# EAGLE design TopHat-V1 (EAGLE 7.4.0)
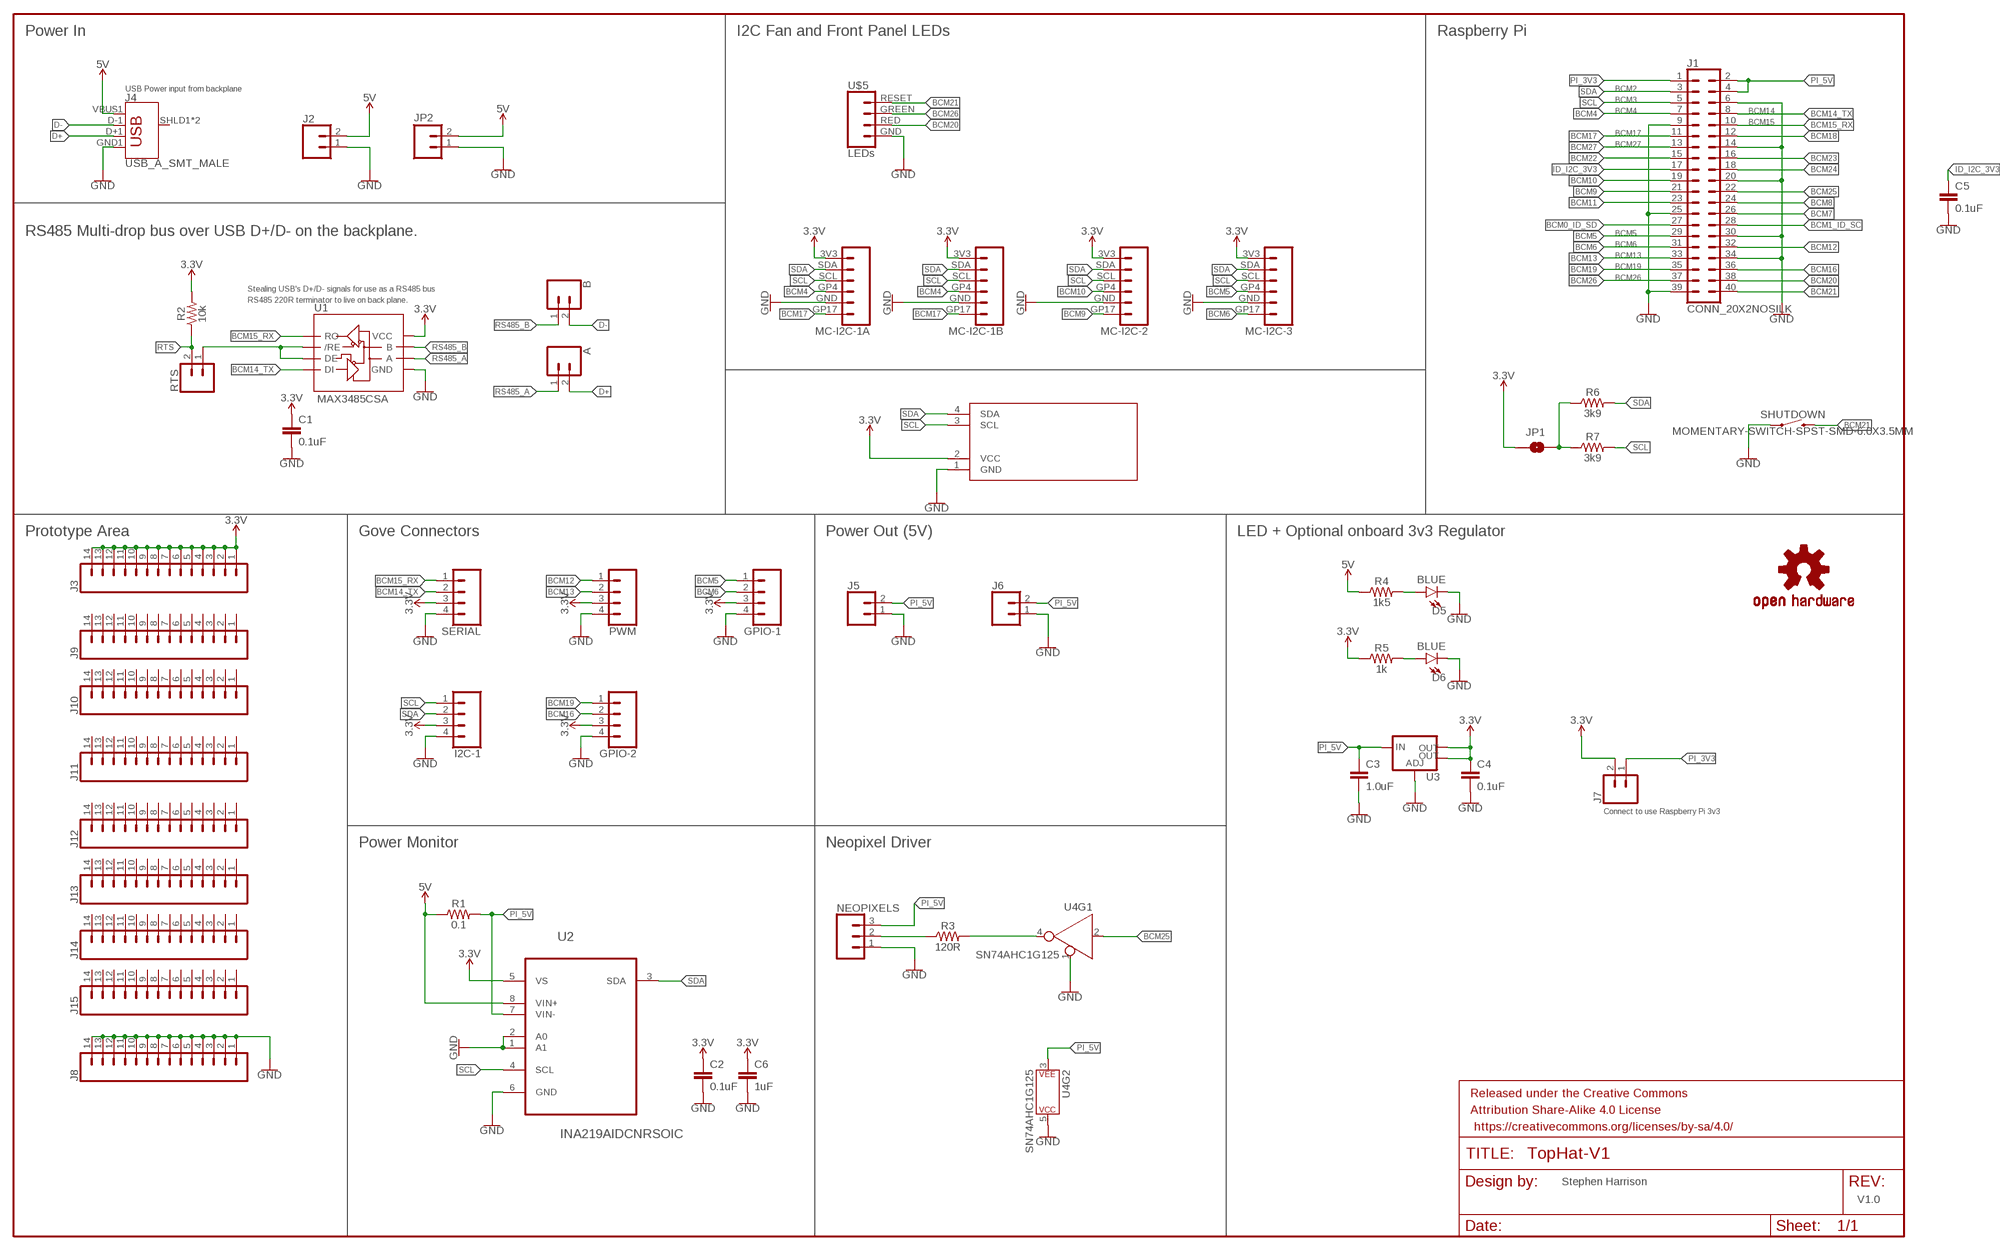
[diagram p0: schematic, sheet 1, part 1 of 2]
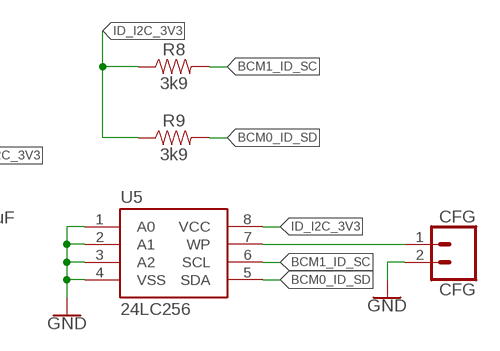
[diagram p1: schematic, sheet 1, part 2 of 2]

## Parts
A  CONN_02  [1X02]
B  CONN_02  [1X02]
C1  0.1uF  1.0UF-0805-25V-(+80/-20%)  [0805]
C2  0.1uF  1.0UF-0805-25V-(+80/-20%)  [0805]
C3  1.0uF  1.0UF-0805-25V-(+80/-20%)  [0805]
C4  0.1uF  1.0UF-0805-25V-(+80/-20%)  [0805]
C5  0.1uF  1.0UF-0805-25V-(+80/-20%)  [0805]
C6  1uF  1.0UF-0805-25V-(+80/-20%)  [0805]
CFG  CFG  CONN_02  [1X02]
D5  BLUE  LED-BLUE1206  [LED-1206]
D6  BLUE  LED-BLUE1206  [LED-1206]
DISPLAY  DISPLAY0.91_INCH_DISPLAY  [I2C_DISPLAY_0.91_INCH]
FRAME1  FRAME-LEDGER  [CREATIVE_COMMONS]
GPIO-1  CONN_04GROVE-JST-PH-4-2MM  [JST-4-PH-GROVE]
GPIO-2  CONN_04GROVE-JST-PH-4-2MM  [JST-4-PH-GROVE]
I2C-1  CONN_04GROVE-JST-PH-4-2MM  [JST-4-PH-GROVE]
J1  CONN_20X2NOSILK  [2X20_NOSILK]
J2  CONN_02POLAR  [MOLEX-1X2]
J3  CONN_14  [1X14]
J4  USB_A_SMT_MALE  [USB-A-SMT-MALE]
J5  CONN_02POLAR  [MOLEX-1X2]
J6  CONN_02POLAR  [MOLEX-1X2]
J7  CONN_02  [1X02]
J8  CONN_14  [1X14]
J9  CONN_14NO_SILK  [1X14_NO_SILK]
J10  CONN_14NO_SILK  [1X14_NO_SILK]
J11  CONN_14NO_SILK  [1X14_NO_SILK]
J12  CONN_14NO_SILK  [1X14_NO_SILK]
J13  CONN_14NO_SILK  [1X14_NO_SILK]
J14  CONN_14NO_SILK  [1X14_NO_SILK]
J15  CONN_14NO_SILK  [1X14_NO_SILK]
JP1  JUMPER-SMT_2_NO_SILK  [SMT-JUMPER_2_NO_SILK]
JP2  M025MM  [SCREWTERMINAL-5MM-2@1]
LOGO1  OSHW-LOGOM  [OSHW-LOGO-M]
MC-I2C-1A  MC_PI_FACE_CONNECTORS_I2CTOP  [JST-6-SH-1.0MM-TOP]
MC-I2C-1B  MC_PI_FACE_CONNECTORS_I2CTOP  [JST-6-SH-1.0MM-TOP]
MC-I2C-2  MC_PI_FACE_CONNECTORS_I2CTOP  [JST-6-SH-1.0MM-TOP]
MC-I2C-3  MC_PI_FACE_CONNECTORS_I2CTOP  [JST-6-SH-1.0MM-TOP]
NEOPIXELS  CONN_03POLAR  [MOLEX-1X3]
PWM  CONN_04GROVE-JST-PH-4-2MM  [JST-4-PH-GROVE]
R1  0.1  0.1OHM-1210-1/2W-1%  [1210]
R2  10k  RESISTOR0805  [0805]
R3  120R  RESISTOR0805  [0805]
R4  1k5  RESISTOR0805  [0805]
R5  1k  RESISTOR0805  [0805]
R6  3k9  RESISTOR0805  [0805]
R7  3k9  RESISTOR0805  [0805]
R8  3k9  RESISTOR0805  [0805]
R9  3k9  RESISTOR0805  [0805]
RTS  CONN_02  [1X02]
SERIAL  CONN_04GROVE-JST-PH-4-2MM  [JST-4-PH-GROVE]
SHUTDOWN  MOMENTARY-SWITCH-SPST-SMD-6.0X3.5MM  [TACTILE_SWITCH_SMD_6.0X3.5MM]
U1  MAX3485CSA  RS485SOIC  [SO08]
U2  INA219AIDCNRSOIC  [SO08]
U3  V_REG_LM1117SOT223  [SOT223]
U4  SN74AHC1G125  74AHC1G125D  [SOT23-5]
U5  24LC256  EEPROM-I2CSMD  [SO08]
U$1  THINGYSTICKS_LOGO  [THINGYSTICKS_LOGO]
U$5  LEDs  MC_PI_FACE_CONNECTORS_LEDSSIDE  [JST-4-SH-1.0MM-SIDE]

## Nets
3.3V: C1.1 C2.1 C4.1 C6.1 DISPLAY.2(VCC) GPIO-1.3 GPIO-2.3 I2C-1.3 J3.1 J3.2 J3.3 J3.4 J3.5 J3.6 J3.7 J3.8 J3.9 J3.10 J3.11 J3.12 J3.13 J3.14 J7.2 JP1.1 MC-I2C-1A.3V3 MC-I2C-1B.3V3 MC-I2C-2.3V3 MC-I2C-3.3V3 PWM.3 R2.2 R5.1 SERIAL.3 U1.8(VCC) U2.5(VS) U3.2(OUT) U3.4(OUT)
5V: J2.2 J4.VBUS1(VBUS) JP2.2 R1.1 R4.1 U2.8(VIN+)
BCM0_ID_SD: J1.27 R9.2 U5.5(SDA)
BCM1_ID_SC: J1.28 R8.2 U5.6(SCL)
BCM4: J1.7 MC-I2C-1A.GP4 MC-I2C-1B.GP4
BCM5: GPIO-1.1 J1.29 MC-I2C-3.GP4
BCM6: GPIO-1.2 J1.31 MC-I2C-3.GP17
BCM7: J1.26
BCM8: J1.24
BCM9: J1.21 MC-I2C-2.GP17
BCM10: J1.19 MC-I2C-2.GP4
BCM11: J1.23
BCM12: J1.32 PWM.1
BCM13: J1.33 PWM.2
BCM14_TX: J1.8 SERIAL.2 U1.4(DI)
BCM15_RX: J1.10 SERIAL.1 U1.1(RO)
BCM16: GPIO-2.2 J1.36
BCM17: J1.11 MC-I2C-1A.GP17 MC-I2C-1B.GP17
BCM18: J1.12
BCM19: GPIO-2.1 J1.35
BCM20: J1.38 U$5.RED
BCM21: J1.40 SHUTDOWN.2 U$5.RESET
BCM22: J1.15
BCM23: J1.16
BCM24: J1.18
BCM25: J1.22 U4.2(A)
BCM26: J1.37 U$5.GREEN
BCM27: J1.13
D+: A.2 J4.D+1(D+)
D-: B.2 J4.D-1(D-)
GND: C1.2 C2.2 C3.2 C4.2 C5.2 C6.2 CFG.2 D5.C D6.C DISPLAY.1(GND) GPIO-1.4 GPIO-2.4 I2C-1.4 J1.6 J1.9 J1.14 J1.20 J1.25 J1.30 J1.34 J1.39 J2.1 J4.GND1(GND) J5.1 J6.1 J8.1 J8.2 J8.3 J8.4 J8.5 J8.6 J8.7 J8.8 J8.9 J8.10 J8.11 J8.12 J8.13 J8.14 JP2.1 MC-I2C-1A.GND MC-I2C-1B.GND MC-I2C-2.GND MC-I2C-3.GND NEOPIXELS.1 PWM.4 SERIAL.4 SHUTDOWN.1 U1.5(GND) U2.1(A1) U2.2(A0) U2.6(GND) U3.1(ADJ) U4.1(!EN) U4.5(P$V+) U5.1(A0) U5.2(A1) U5.3(A2) U5.4(VSS) U$5.GND
ID_I2C_3V3: C5.1 J1.17 R8.1 R9.1 U5.8(VCC)
N$1: CFG.1 U5.7(WP)
N$2: D6.A R5.2
N$4: D5.A R4.2
N$6: RTS.1 U1.2(/RE) U1.3(DE)
N$7: JP1.2 R6.1 R7.1
N$8: NEOPIXELS.2 R3.1
N$9: R3.2 U4.4(Y)
PI_3V3: J1.1 J7.1
PI_5V: C3.1 J1.2 J1.4 J5.2 J6.2 NEOPIXELS.3 R1.2 U2.7(VIN-) U3.3(IN) U4.3(P$V-)
RS485_A: A.1 U1.6(A)
RS485_B: B.1 U1.7(B)
RTS: R2.1 RTS.2
SCL: DISPLAY.3(SCL) I2C-1.1 J1.5 MC-I2C-1A.SCL MC-I2C-1B.SCL MC-I2C-2.SCL MC-I2C-3.SCL R7.2 U2.4(SCL)
SDA: DISPLAY.4(SDA) I2C-1.2 J1.3 MC-I2C-1A.SDA MC-I2C-1B.SDA MC-I2C-2.SDA MC-I2C-3.SDA R6.2 U2.3(SDA)
Unconnected: J4.SHLD1(SHIELD) J4.SHLD2(SHIELD) J9.1 J9.2 J9.3 J9.4 J9.5 J9.6 J9.7 J9.8 J9.9 J9.10 J9.11 J9.12 J9.13 J9.14 J10.1 J10.2 J10.3 J10.4 J10.5 J10.6 J10.7 J10.8 J10.9 J10.10 J10.11 J10.12 J10.13 J10.14 J11.1 J11.2 J11.3 J11.4 J11.5 J11.6 J11.7 J11.8 J11.9 J11.10 J11.11 J11.12 J11.13 J11.14 J12.1 J12.2 J12.3 J12.4 J12.5 J12.6 J12.7 J12.8 J12.9 J12.10 J12.11 J12.12 J12.13 J12.14 J13.1 J13.2 J13.3 J13.4 J13.5 J13.6 J13.7 J13.8 J13.9 J13.10 J13.11 J13.12 J13.13 J13.14 J14.1 J14.2 J14.3 J14.4 J14.5 J14.6 J14.7 J14.8 J14.9 J14.10 J14.11 J14.12 J14.13 J14.14 J15.1 J15.2 J15.3 J15.4 J15.5 J15.6 J15.7 J15.8 J15.9 J15.10 J15.11 J15.12 J15.13 J15.14

## Notes on the sheet
- Power In | I2C Fan and Front Panel LEDs | Raspberry Pi
- USB Power input from backplane | BCM2
- BCM3
- BCM4 | BCM14
- BCM15
- BCM17
- BCM27
- RS485 Multi-drop bus over USB D+/D- on the backplane. | BCM5
- BCM6
- BCM13
- BCM19
- BCM26
- Stealing USB's D+/D- signals for use as a RS485 bus
- RS485 220R terminator to live on back plane.
- Prototype Area | Gove Connectors | Power Out (5V) | LED + Optional onboard 3v3 Regulator
- Connect to use Raspberry Pi 3v3
- Power Monitor | Neopixel Driver
- Stephen Harrison
- V1.0

## Library data of the parts
A B CFG J7 RTS = SparkFun-Connectors:CONN_02: Multi connection point. Often used as Generic Header-pin footprint for 0.1 inch spaced/style header connections On any of the 0.1 inch spaced packages, you can populate with these: Break Away Headers - Straight <https://www.sparkfun.com/products/116> (PRT-00116) Break Away Male Headers - Right Angle <https://www.sparkfun.com/products/553> (PRT-00553) Female Headers <https://www.sparkfun.com/products/115> (PRT-00115) Break Away Headers - Machine Pin <https://www.sparkfun.com/products/117> (PRT-00117) Break Away Female Headers - Swiss Machine Pin <https://www.sparkfun.com/products/743> (PRT-00743) For SCREWTERMINALS and SPRING TERMINALS visit here: Screw Terimnals on SparkFun.com <https://www.sparkfun.com/search/results?term=Screw+Terminals> (5mm/3.5mm/2.54mm spacing) This device is also useful as a general connection point to wire up your design to another part of your project. Our various solder wires solder well into these plated through hole pads. Hook-Up Wire - Assortment (Stranded, 22 AWG) <https://www.sparkfun.com/products/11375> (PRT-11375) Hook-Up Wire - Assortment (Solid Core, 22 AWG) <https://www.sparkfun.com/products/11367> (PRT-11367) View the entire wire category on our website here <https://www.sparkfun.com/categories/141> Special notes: Molex polarized connector foot print use with: PRT-08233 with associated crimp pins and housings. 2.54_SCREWTERM for use with PRT-10571. 3.5mm Screw Terminal footprints for PRT-08084 5mm Screw Terminal footprints for use with PRT-08432
C1 C2 C4-C6 = SparkFun-Capacitors:1.0UF: 1µF ceramic capacitors A capacitor is a passive two-terminal electrical component used to store electrical energy temporarily in an electric field.; PROD_ID: CAP-11625; VALUE: 1.0uF
C3 = SparkFun-Capacitors:1.0UF: 1µF ceramic capacitors A capacitor is a passive two-terminal electrical component used to store electrical energy temporarily in an electric field.; PROD_ID: CAP-11625
D5 D6 = SparkFun-LED:LED-BLUE: Blue SMD LED Used in manufacturing of various products at SparkFun Packages: 0603 - SMD 0603 package [Product Link] <http://www.digikey.com/product-detail/en/SMLE12BC7TT86/511-1589-2-ND/1641808> 1206 - SMD1206 package [Product Link] <http://www.digikey.com/product-detail/en/lite-on-inc/LTST-C150TBKT/160-1643-1-ND/573584> SparkFun Products: ESP8266 Thing-Dev Board <https://www.sparkfun.com/products/13711> RedBoard <https://www.sparkfun.com/products/12757>; PROD_ID: DIO-09911
DISPLAY = ThingySticks:DISPLAY
FRAME1 = SparkFun-Aesthetics:FRAME-LEDGER: Schematic Frame - Ledger Standard 11x14 US Ledger frame
GPIO-1 GPIO-2 I2C-1 PWM SERIAL = ThingySticks:CONN_04: Multi connection point. Often used as Generic Header-pin footprint for 0.1 inch spaced/style header connections On any of the 0.1 inch spaced packages, you can populate with these: Break Away Headers - Straight <https://www.sparkfun.com/products/116> (PRT-00116) Break Away Male Headers - Right Angle <https://www.sparkfun.com/products/553> (PRT-00553) Female Headers <https://www.sparkfun.com/products/115> (PRT-00115) Break Away Headers - Machine Pin <https://www.sparkfun.com/products/117> (PRT-00117) Break Away Female Headers - Swiss Machine Pin <https://www.sparkfun.com/products/743> (PRT-00743) For SCREWTERMINALS and SPRING TERMINALS visit here: Screw Terimnals on SparkFun.com <https://www.sparkfun.com/search/results?term=Screw+Terminals> (5mm/3.5mm/2.54mm spacing) This device is also useful as a general connection point to wire up your design to another part of your project. Our various solder wires solder well into these plated through hole pads. Hook-Up Wire - Assortment (Stranded, 22 AWG) <https://www.sparkfun.com/products/11375> (PRT-11375) Hook-Up Wire - Assortment (Solid Core, 22 AWG) <https://www.sparkfun.com/products/11367> (PRT-11367) View the entire wire category on our website here <https://www.sparkfun.com/categories/141> Special notes: Molex polarized connector foot print use with SKU : PRT-08231 with associated crimp pins and housings. 1MM SMD Version SKU: PRT-10208
J1 = SparkFun-Connectors:CONN_20X2: Multi connection point. Often used as Generic Header-pin footprint for 0.1 inch spaced/style header connections On any of the 0.1 inch spaced packages, you can populate with these: Break Away Headers - Straight <https://www.sparkfun.com/products/116> (PRT-00116) Break Away Male Headers - Right Angle <https://www.sparkfun.com/products/553> (PRT-00553) Female Headers <https://www.sparkfun.com/products/115> (PRT-00115) Break Away Headers - Machine Pin <https://www.sparkfun.com/products/117> (PRT-00117) Break Away Female Headers - Swiss Machine Pin <https://www.sparkfun.com/products/743> (PRT-00743)
J2 J5 J6 = SparkFun-Connectors:CONN_02: Multi connection point. Often used as Generic Header-pin footprint for 0.1 inch spaced/style header connections On any of the 0.1 inch spaced packages, you can populate with these: Break Away Headers - Straight <https://www.sparkfun.com/products/116> (PRT-00116) Break Away Male Headers - Right Angle <https://www.sparkfun.com/products/553> (PRT-00553) Female Headers <https://www.sparkfun.com/products/115> (PRT-00115) Break Away Headers - Machine Pin <https://www.sparkfun.com/products/117> (PRT-00117) Break Away Female Headers - Swiss Machine Pin <https://www.sparkfun.com/products/743> (PRT-00743) For SCREWTERMINALS and SPRING TERMINALS visit here: Screw Terimnals on SparkFun.com <https://www.sparkfun.com/search/results?term=Screw+Terminals> (5mm/3.5mm/2.54mm spacing) This device is also useful as a general connection point to wire up your design to another part of your project. Our various solder wires solder well into these plated through hole pads. Hook-Up Wire - Assortment (Stranded, 22 AWG) <https://www.sparkfun.com/products/11375> (PRT-11375) Hook-Up Wire - Assortment (Solid Core, 22 AWG) <https://www.sparkfun.com/products/11367> (PRT-11367) View the entire wire category on our website here <https://www.sparkfun.com/categories/141> Special notes: Molex polarized connector foot print use with: PRT-08233 with associated crimp pins and housings. 2.54_SCREWTERM for use with PRT-10571. 3.5mm Screw Terminal footprints for PRT-08084 5mm Screw Terminal footprints for use with PRT-08432; SF_ID: PRT-09918
J3 J8-J15 = SparkFun-Connectors:CONN_14: Multi connection point. Often used as Generic Header-pin footprint for 0.1 inch spaced/style header connections On any of the 0.1 inch spaced packages, you can populate with these: Break Away Headers - Straight <https://www.sparkfun.com/products/116> (PRT-00116) Break Away Male Headers - Right Angle <https://www.sparkfun.com/products/553> (PRT-00553) Female Headers <https://www.sparkfun.com/products/115> (PRT-00115) Break Away Headers - Machine Pin <https://www.sparkfun.com/products/117> (PRT-00117) Break Away Female Headers - Swiss Machine Pin <https://www.sparkfun.com/products/743> (PRT-00743) For SCREWTERMINALS and SPRING TERMINALS visit here: Screw Terimnals on SparkFun.com <https://www.sparkfun.com/search/results?term=Screw+Terminals> (5mm/3.5mm/2.54mm spacing) This device is also useful as a general connection point to wire up your design to another part of your project. Our various solder wires solder well into these plated through hole pads. Hook-Up Wire - Assortment (Stranded, 22 AWG) <https://www.sparkfun.com/products/11375> (PRT-11375) Hook-Up Wire - Assortment (Solid Core, 22 AWG) <https://www.sparkfun.com/products/11367> (PRT-11367) View the entire wire category on our website here <https://www.sparkfun.com/categories/141> Special notes: Molex polarized connector foot print use with SKU : PRT-08231 with associated crimp pins and housings. 1MM SMD Version SKU: PRT-10208 NOTES ON THE VARIANTS LOCK and LOCK_LONGPADS... This footprint was designed to help hold the alignment of a through-hole component (i.e. 6-pin header) while soldering it into place. You may notice that each hole has been shifted either up or down by 0.005 of an inch from it's more standard position (which is a perfectly straight line). This slight alteration caused the pins (the squares in the middle) to touch the edges of the holes. Because they are alternating, it causes a "brace" to hold the component in place. 0.005 has proven to be the perfect amount of "off-center" position when using our standard breakaway headers. Although looks a little odd when you look at the bare footprint, once you have a header in there, the alteration is very hard to notice. Also,if you push a header all the way into place, it is covered up entirely on the bottom side.
J4 = Tinamous:USB_A: USB-A Connector Male and female variants, as well as PTH and SMT variants SparkFun Products: SparkFun XBee Explorer Dongle <https://www.sparkfun.com/products/11697> PTH Male SparkFun MicroView-USB Programmer <https://www.sparkfun.com/products/12924> SMT Male SparkFun USB Type A Female Breakout <https://www.sparkfun.com/products/12700> SMT Female; PROD_ID: CONN-11499
JP1 = SparkFun-Jumpers:JUMPER-SMT_2_NO: Normally open jumper This jumper has two pads in close proximity to each other. Apply solder to close the connection. Round pads are easier to solder for beginners, but are a lot larger. SparkFun Product that uses the round pads: SparkFun EL Sequencer <https://www.sparkfun.com/products/12781>
JP2 = SparkFun-Connectors:M02: Standard 2-pin 0.1" header. Use with - straight break away headers ( PRT-00116) - right angle break away headers (PRT-00553) - swiss pins (PRT-00743) - machine pins (PRT-00117) - female headers (PRT-00115) Molex polarized connector foot print use with: PRT-08233 with associated crimp pins and housings. 2.54_SCREWTERM for use with PRT-10571. 3.5mm Screw Terminal footprints for PRT-08084 5mm Screw Terminal footprints for use with PRT-08432; STOREFRONT_ID: PRT-08432
LOGO1 = Tinamous:OSHW-LOGO: Open Source Hardware Logo This logo indicates the piece of hardware it is found on incorporates a OSHW license and/or adheres to the definition of open source hardware found here: http://freedomdefined.org/OSHW
MC-I2C-1A MC-I2C-1B MC-I2C-2 MC-I2C-3 = McPiFace:MC_PI_FACE_CONNECTORS_I2C
NEOPIXELS = SparkFun-Connectors:CONN_03: Multi connection point. Often used as Generic Header-pin footprint for 0.1 inch spaced/style header connections On any of the 0.1 inch spaced packages, you can populate with these: Break Away Headers - Straight <https://www.sparkfun.com/products/116> (PRT-00116) Break Away Male Headers - Right Angle <https://www.sparkfun.com/products/553> (PRT-00553) Female Headers <https://www.sparkfun.com/products/115> (PRT-00115) Break Away Headers - Machine Pin <https://www.sparkfun.com/products/117> (PRT-00117) Break Away Female Headers - Swiss Machine Pin <https://www.sparkfun.com/products/743> (PRT-00743) Stackable Header - 3 Pin (Female, 0.1") <https://www.sparkfun.com/products/13875> (PRT-13875) For SCREWTERMINALS and SPRING TERMINALS visit here: Screw Terimnals on SparkFun.com <https://www.sparkfun.com/search/results?term=Screw+Terminals> (5mm/3.5mm/2.54mm spacing) This device is also useful as a general connection point to wire up your design to another part of your project. Our various solder wires solder well into these plated through hole pads. Hook-Up Wire - Assortment (Stranded, 22 AWG) <https://www.sparkfun.com/products/11375> (PRT-11375) Hook-Up Wire - Assortment (Solid Core, 22 AWG) <https://www.sparkfun.com/products/11367> (PRT-11367) View the entire wire category on our website here <https://www.sparkfun.com/categories/141> Special notes: Molex polarized connector foot print use with SKU : PRT-08232 with associated crimp pins and housings.; PROD_ID: CONN-08625; SF_ID: PRT-08096
R1 = SparkFun-Resistors:0.1OHM: 0.1Ω resistor A resistor is a passive two-terminal electrical component that implements electrical resistance as a circuit element. Resistors act to reduce current flow, and, at the same time, act to lower voltage levels within circuits. - Wikipedia; PROD_ID: RES-12374
R2-R9 = SparkFun-Resistors:RESISTOR: Generic Resistor Package
SHUTDOWN = ThingySticks:MOMENTARY-SWITCH-SPST: Momentary Switch (Pushbutton) - SPST Normally-open (NO) SPST momentary switches (buttons, pushbuttons). Variants PTH-12MM - 12mm square, through-hole Momentary Pushbutton Switch - 12mm Square <https://www.sparkfun.com/products/9190> (COM-09190) PTH-6.0MM, PTH-6.0MM-KIT - 6.0mm square, through-hole Mini Pushbutton Switch <https://www.sparkfun.com/products/97> (COM-00097) KIT package intended for soldering kit's - only one side of pads' copper is exposed. PTH-RIGHT-ANGLE-KIT - Right-angle, through-hole Right Angle Tactile Button <https://www.sparkfun.com/products/10791> - Used on SparkFun BigTime Watch Kit <https://www.sparkfun.com/products/11734> SMD-12MM - 12mm square, surface-mount Tactile Button - SMD (12mm) <https://www.sparkfun.com/products/12993> (COM-12993) Used on SparkFun PicoBoard <https://www.sparkfun.com/products/11888> SMD-4.5MM - 4.5mm Square Trackball Switch Used on SparkFun Blackberry Trackballer Breakout <https://www.sparkfun.com/products/13169> SMD-4.6MMX2.8MM - 4.60mm x 2.80mm, surface mount Used on SparkFun SAMD21 Mini Breakout <https://www.sparkfun.com/products/13664> SMD-5.2MM, SMD-5.2-REDUNDANT - 5.2mm square, surface-mount Mini Pushbutton Switch - SMD <https://www.sparkfun.com/products/8720> (COM-08720) Used on Arduino Pro Mini <https://www.sparkfun.com/products/11114> REDUNDANT package connects both switch circuits together SMD-6.0X3.5MM - 6.0 x 3.5mm, surface mount Momentary Reset Switch SMD <https://www.sparkfun.com/products/8229> (COM-08229) SMD-6.2MM-TALL - 6.2mm square, surface mount Tactile Button - SMD (6mm) <https://www.sparkfun.com/products/12992> Used on SparkFun Digital Sandbox <https://www.sparkfun.com/products/12651> SMD-RIGHT-ANGLE - Right-angle, surface mount Used on SparkFun Block for Intel® Edison - Arduino <https://www.sparkfun.com/products/13036>; PROD_ID: SWCH-00815; SF_SKU: COM-08229
U1 = SparkFun-IC-Comms:RS485: RS-485 Transceiver SP3485 Series 8 Pin NSOIC 3.3 V Low Power Half Duplex RS-485 Transceiver MAX3485 compatible Datasheet <http://www.sparkfun.com/datasheets/Components/General/sp3485CN-LTR.pdf> SparkFun Products SparkFun Transceiver Breakout - RS-485 <https://www.sparkfun.com/products/10124> (BOB-10124) SparkFun USB to RS-485 Converter <https://www.sparkfun.com/products/9822> (BOB-09822); PROD_ID: IC-09388
U2 = INA219AIDCNR:INA219AIDCNR: CURRENT/POWER MONITOR
U3 = SparkFun-PowerIC:V_REG_LM1117: Voltage Regulator LM1117 Standard adjustable voltage regulator but in SMD form. Spark Fun Electronics SKU : COM-00595; PROD_ID: VREG-08170
U4 = SparkFun-IC-Logic:74*1G125: Single buffer Buffers & Line Drivers Tri-State Single Bus SOT-23-5 Datasheet SparkFun Products SparkFun SAMD21 Mini Breakout <https://www.sparkfun.com/products/13664> (DEV-13664) SparkFun SAMD21 Dev Breakout <https://www.sparkfun.com/products/13672> (DEV-13672) SparkFun MIDI Shield <https://www.sparkfun.com/products/12898> (DEV-12898) SparkFun WiFi Shield - CC3000 <https://www.sparkfun.com/products/12071> (DEV-12071); PROD_ID: IC-11920
U5 = SparkFun-IC-Memory:EEPROM-I2C: I2C EEPROMs, 24LC256 and others 24LC256 Series 256 kb I2C 2 Wire (32 k x 8 Bit) 2.5 V Serial EEPROM SMD - SOIC-8 Datasheet SparkFun Products SparkFun UDB5 - PIC UAV Development Board <https://www.sparkfun.com/products/11703> (GPS-11703); PROD_ID: IC-09714
U$1 = ThingySticks:THINGYSTICKS_LOGO
U$5 = McPiFace:MC_PI_FACE_CONNECTORS_LEDS; FARNELL: 1830839; MFG: SM04B-SRSS-TB(LF)(SN)

## Board
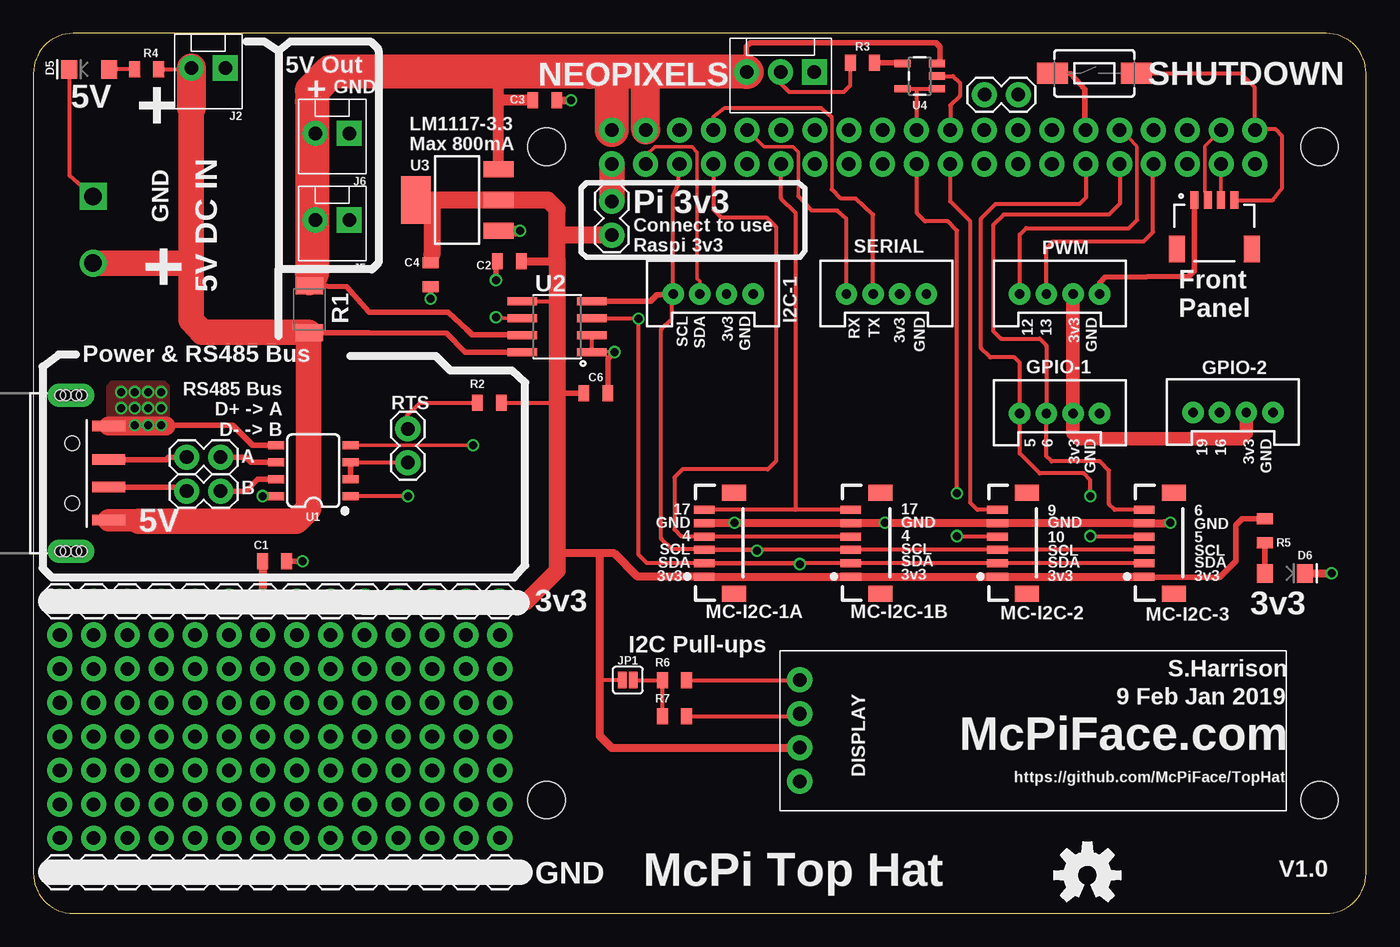
[diagram p2: board, top side]
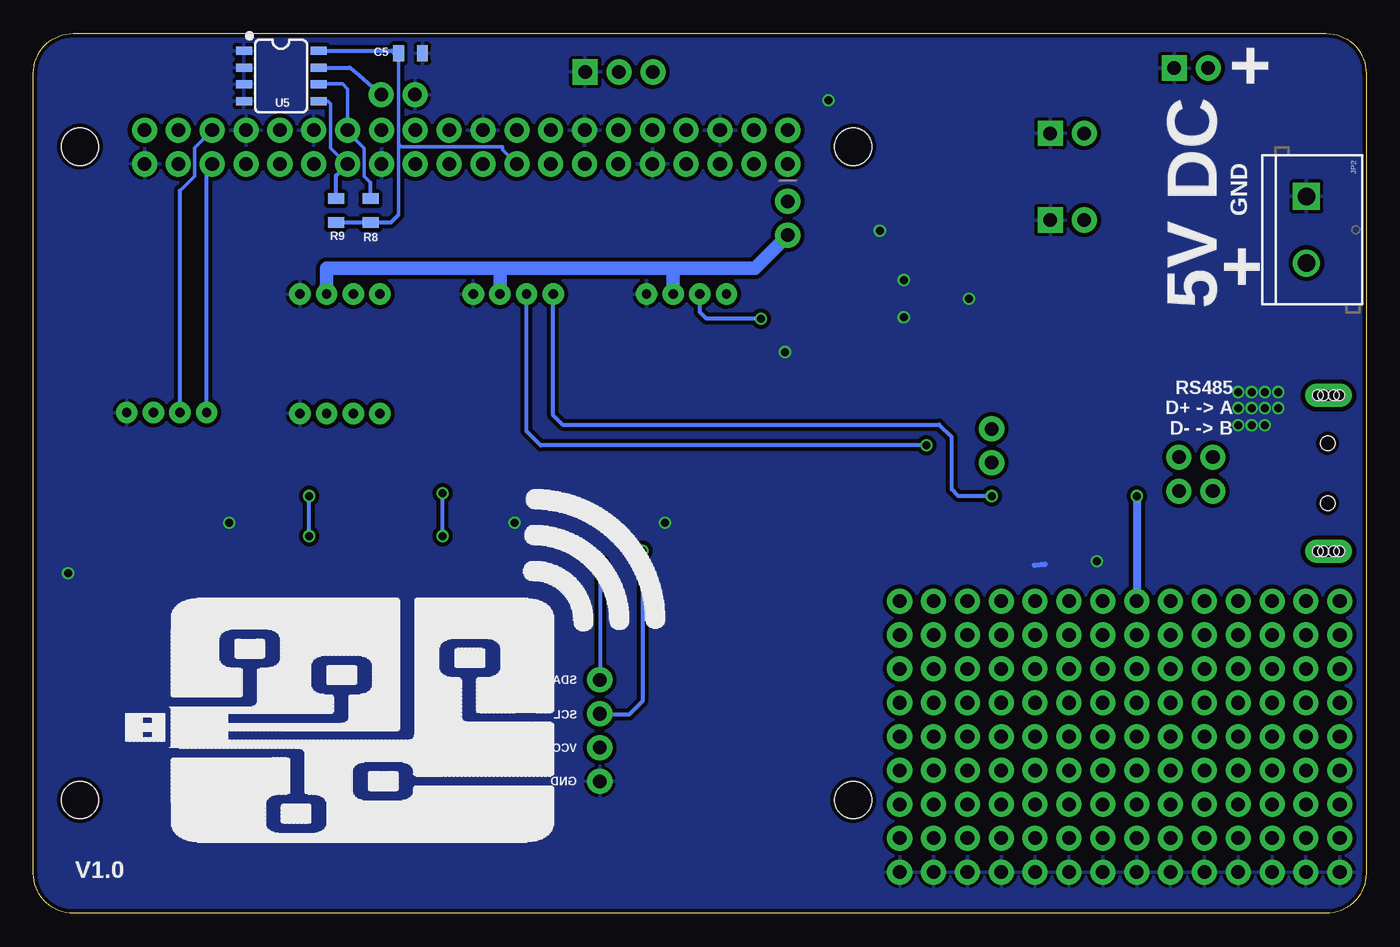
[diagram p3: board, bottom side, seen from below]

Size 100 x 66 mm. Coordinates in mm from the lower left corner, seen from the top.
Outline: 0,3 arc90 3,0 97,0 arc90 100,3 100,63 arc90 97,66 3,66 arc90 0,63 0,3
Copper layers (1*16): Top 0.035mm / dielectric 1.5mm / Bottom 0.035mm
Design rules "dirt_cheap_dirty_boards.v1 *": minimum track width 6mil, minimum drill 12mil, track to track 6mil, track to pad 6mil, pad to pad 6mil, via to via 6mil, smd to smd 0mil, copper to edge 10mil, drill to drill 10mil, minimum pad ring 10mil, minimum via ring 6mil, stop-mask expansion 2mil, vias tented up to drill 25mil, thermal gap 10mil
Holes 2.8 mm at 38.5,57.5 96.5,57.5 38.5,8.5 96.5,8.5

### Footprints (pad centres in the part's own frame; a part is rotated, then mirrored left to right if it is on the bottom)
1X02 = drill 1.016 pad 1.88: 1 0,0; 2 2.54,0
0805 = smd 0.8 x 1.2: 1 -0.9,0; 2 0.9,0
LED-1206 = smd 1.2 x 1.4: A -1.5,0; C 1.5,0
I2C_DISPLAY_0.91_INCH = drill 1.016 pad 1.88: 1 1.5,2.19; 2 1.5,4.73; 3 1.5,7.27; 4 1.5,9.81
JST-4-PH-GROVE = drill 0.7 pad 1.6: 1 -3,-0.55; 2 -1,-0.55; 3 1,-0.55; 4 3,-0.55
2X20_NOSILK = drill 1.016 pad 1.88: 1 0,0; 2 0,2.54; 3 2.54,0; 4 2.54,2.54; 5 5.08,0; 6 5.08,2.54; 7 7.62,0; 8 7.62,2.54; 9 10.16,0; 10 10.16,2.54; 11 12.7,0; 12 12.7,2.54; 13 15.24,0; 14 15.24,2.54; 15 17.78,0; 16 17.78,2.54; 17 20.32,0; 18 20.32,2.54; 19 22.86,0; 20 22.86,2.54; 21 25.4,0; 22 25.4,2.54; 23 27.94,0; 24 27.94,2.54; 25 30.48,0; 26 30.48,2.54; 27 33.02,0; 28 33.02,2.54; 29 35.56,0; 30 35.56,2.54; 31 38.1,0; 32 38.1,2.54; 33 40.64,0; 34 40.64,2.54; 35 43.18,0; 36 43.18,2.54; 37 45.72,0; 38 45.72,2.54; 39 48.26,0; 40 48.26,2.54
MOLEX-1X2 = drill 1.016 pad 1.88 square: 1 0,0 | drill 1.016 pad 1.88: 2 2.54,0
1X14 = drill 1.016 pad 1.88: 1 0,0; 2 2.54,0; 3 5.08,0; 4 7.62,0; 5 10.16,0; 6 12.7,0; 7 15.24,0; 8 17.78,0; 9 20.32,0; 10 22.86,0; 11 25.4,0; 12 27.94,0; 13 30.48,0; 14 33.02,0
USB-A-SMT-MALE = smd 2.5 x 0.8: D+1 10.95,1.027; D-1 10.95,-1.027; GND1 10.95,3.551; VBUS1 10.95,-3.5 | drill 0.8 pad 1.778 long: SHLD1 8.13,-5.85; SHLD2 8.13,5.85 | hole 1.1: 8.2,2.25; 8.2,-2.25 | hole 0.8: 8.53,-5.85; 8.93,-5.85; 7.73,-5.85; 7.33,-5.85; 8.53,5.85; 8.93,5.85; 7.73,5.85; 7.33,5.85
1X14_NO_SILK = drill 1.016 pad 1.88: 1 0,0; 2 2.54,0; 3 5.08,0; 4 7.62,0; 5 10.16,0; 6 12.7,0; 7 15.24,0; 8 17.78,0; 9 20.32,0; 10 22.86,0; 11 25.4,0; 12 27.94,0; 13 30.48,0; 14 33.02,0
SMT-JUMPER_2_NO_SILK = smd 0.635 x 1.27: 1 -0.406,0; 2 0.406,0
SCREWTERMINAL-5MM-2@1 = drill 1.3 pad 2.032 square: 1 0,0 | drill 1.3 pad 2.032: 2 5,0
JST-6-SH-1.0MM-TOP = smd 0.6 x 1.55: 3V3 -2.54,1.27; GND 1.46,1.27; GP4 0.46,1.27; GP17 2.46,1.27; SCL -0.54,1.27; SDA -1.54,1.27 | smd 1.2 x 1.8: P$1 -3.84,-0.955; P$2 3.76,-0.955
MOLEX-1X3 = drill 1.016 pad 1.88 square: 1 0,0 | drill 1.016 pad 1.88: 2 2.54,0; 3 5.08,0
1210 = smd 1.27 x 2.06: 1 -1.755,0; 2 1.755,0
TACTILE_SWITCH_SMD_6.0X3.5MM = smd 2.3 x 1.6: 1 -3.15,0; 2 3.15,0
SO08 = smd 0.6 x 1.2: 1 -1.905,-2.8; 2 -0.635,-2.8; 3 0.635,-2.8; 4 1.905,-2.8; 5 1.905,2.8; 6 0.635,2.8; 7 -0.635,2.8; 8 -1.905,2.8
SO08' = smd 0.61 x 2.21: 1 -1.905,-2.616; 2 -0.635,-2.616; 3 0.635,-2.616; 4 1.905,-2.616; 5 1.905,2.616; 6 0.635,2.616; 7 -0.635,2.616; 8 -1.905,2.616
SOT223 = smd 1.219 x 2.235: 1 -2.311,-3.099; 2 0,-3.099; 3 2.311,-3.099 | smd 3.6 x 2.2: 4 0,3.099
SOT23-5 = smd 0.55 x 1.2: 1 -0.95,-1.3; 2 0,-1.3; 3 0.95,-1.3; 4 0.95,1.3; 5 -0.95,1.3
JST-4-SH-1.0MM-SIDE = smd 0.6 x 1.35: GND -1.5,0; GREEN 0.5,0; RED -0.5,0; RESET 1.5,0 | smd 1.2 x 2: NC1 2.8,-3.675; NC2 -2.8,-3.675

### Placement (x,y rotation side)
A  14.05,34.21 180 top
B  14.05,31.67 180 top
C1  18.1,26.4 0 top
C2  35.7,48.9 180 top
C3  38.37,60.97 0 top
C4  29.8,47.9 270 top
C5  71.7,64.5 0 bottom
C6  42.2,39 0 top
CFG  73.9,61.4 180 top
D5  4.2,63.3 180 top
D6  93.9,25.5 0 top
DISPLAY  56,7.7 0 top
FRAME1  15.6,-10.6 0 top  (outside the outline)
GPIO-1  77,38.05 0 top
GPIO-2  90,38.1 0 top
I2C-1  51,47 0 top
J1  43.4,56.2 0 top
J2  14.4,63.4 180 top
J3  1.98,23.41 0 top
J4  -5.3,33 0 top
J5  23.7,52 180 top
J6  23.7,58.5 180 top
J7  43.4,53.4 270 top
J8  1.98,3.09 0 top
J9  1.98,20.88 0 top
J10  1.98,18.34 0 top
J11  1.98,15.79 0 top
J12  1.98,13.26 0 top
J13  1.98,10.71 0 top
J14  1.98,8.18 0 top
J15  1.98,5.63 0 top
JP1  44.6,17.5 0 top
JP2  4.48,53.77 270 bottom
LOGO1  79.08,2.86 0 bottom
MC-I2C-1A  51.6,27.8 90 top
MC-I2C-1B  62.6,27.8 90 top
MC-I2C-2  73.6,27.8 90 top
MC-I2C-3  84.6,27.8 90 top
NEOPIXELS  58.6,63.1 180 top
PWM  77,47 0 top
R1  20.7,45.3 90 top
R2  34.2,38.3 0 top
R3  62.2,63.8 0 top
R4  8.5,63.3 180 top
R5  92.4,28.7 270 top
R6  48.1,17.5 0 top
R7  48.1,14.8 0 top
R8  74.7,52.7 90 bottom
R9  77.3,52.7 90 bottom
RTS  28.1,33.8 90 top
SERIAL  64,47 0 top
SHUTDOWN  79.6,63 0 top
U1  21,33.2 90 top
U2  INA219AIDCNRSOIC  [SO08']  39.3,44 90 top
U3  31.8,53.5 90 top
U4  66.5,62.8 90 top
U5  81.4,62.8 270 bottom
U$1  94.15,4.5 0 bottom
U$5  88.6,53.5 0 top

### Tracks (layer width: path | path; a pad name or v marks a point on that pad's centre or on a via)
3.3V  (via drill 0.6)
  Top 0.305: U2.5 39.3,45.91 39.3,45 | 17.59,31.3 U1.8 | 57.47,12.4 DISPLAY.2 56.43,12.43 56.4,12.4 | JP1.1 42.5,17.5 | R2.2 39.2,38.3 39.3,38.2
  Top 0.406: 29.7,53.4 29.28,53.44 U3.4 | C4.1 29.8,49.3 29.9,49.4 | R5.1 90.7,29.6 90.2,29.1 90.2,26.4 89,25.2 83.39,25.2 MC-I2C-3.3V3 | C6.1 39.3,39
  Top 0.61: J3.12 33.73,23.41 | v17.2,31.3 17.59,31.3 | C2.1 39.2,48.9 39.3,49 | C1.1 17.2,23.43 J3.7 | MC-I2C-3.3V3 MC-I2C-2.3V3 MC-I2C-1B.3V3 MC-I2C-1A.3V3 45.34,25.26 43.6,27 42.5,27 | 42.5,27 39.5,27 39.3,27.2 | 57.5,12.4 56.4,12.4 43.4,12.4 42.5,13.3 42.5,17.5 42.5,27
  Top 0.813: J3.1 J3.2 J3.3 J3.4 J3.5 J3.6 J3.7 J3.8 J3.9 J3.10 J3.11 J3.12 J3.13 33.73,23.41 J3.14
  Top 1.016: 29.7,53.4 29.9,53.4 | 78,42.9 PWM.3 GPIO-1.3 78,36 78.4,35.6 90.6,35.6 91,36 GPIO-2.3
  Top 1.27: 29.9,23.43 J3.12 | 29.9,53.4 29.9,49.4 | 39.3,51.1 39.3,49 39.3,45 39.3,39 39.3,38.2 39.3,27.2 39.3,25.7 37,23.4 35.02,23.4 J3.14 | 39.3,51.1 39.3,52.8 38.6,53.5 U3.2 29.34,53.5 29.28,53.44 | J7.2 39.54,50.86 39.3,51.1
  Bottom 0.406: 78.1,48.3 78,48.4
  Bottom 0.61: v17.2,31.3 17.2,23.77
  Bottom 0.813: 17.2,23.77 17.2,23.43 J3.7
  Bottom 1.016: PWM.3 78,48.4 65,48.4 | 65,48.4 52,48.4 | 52,48.4 I2C-1.3 | SERIAL.3 65,48.4 | 52,48.4 45.86,48.4 J7.2
  Bottom 1.27: 14.5,23.59 J3.6
5V
  Top 0.305: 11.2,61.5 11.3,61.6 11.3,62.84 J2.2 11.9,63.44 11.7,63.3 R4.1
  Top 0.406: R1.1 25.14,43.55 31,43.5 32.4,42.1 35.78,42.1 U2.8
  Top 0.813: 7.7,29.4 7.8,29.5
  Top 1.676: J4.VBUS1 7.8,29.5 7.9,29.4
  Top 1.93: 7.9,29.4 19.7,29.4 20.64,30.34 20.64,43.49 R1.1 20.64,43.6 12.65,43.6 11.86,44.49 11.86,48.6 | 11.86,60.44 11.86,48.6 | JP2.2 11.69,48.77 11.86,48.6
  Top 2.184: J2.2 11.86,60.44
BCM0_ID_SD
  Bottom 0.254: 76.5,56.2 77.7,57.4 77.7,60.7 77.9,60.9 U5.5
  Bottom 0.305: 76.5,56.2 J1.27 77.3,55.32 R9.2 | U5.5
BCM1_ID_SC
  Bottom 0.254: J1.28 76.42,61.82 76.8,62.2 78.56,62.2 | 74.7,54.8 75.2,55.3 75.2,57.4 76.42,58.62
  Bottom 0.305: 78.56,62.2 U5.6 | R8.2 74.7,54.8 | J1.28 76.42,58.62
BCM4
  Top 0.305: J1.7 51.02,52.78 51.6,52.2 55,52.2 55.7,51.5 55.7,33.9 55.1,33.3 48.7,33.3 48.1,32.7 48.1,28.8 48.6,28.3 50.29,28.3 MC-I2C-1A.GP4 MC-I2C-1B.GP4
BCM5  (via drill 0.6)
  Top 0.305: J1.29 79,56.16 79,53.7 78.5,53.2 72.2,53.2 71.1,52.1 71.1,42.4 71.8,41.7 73.6,41.7 74,41.3 GPIO-1.1 74,34.5 75.5,33 78.8,33 79.3,32.5 v79.3,31.3 | MC-I2C-3.GP4 79.34,28.26 v79.3,28.3
  Bottom 0.305: v79.3,28.3 v79.3,31.3
BCM6
  Top 0.305: J1.31 81.5,53.2 80.7,52.4 72.8,52.4 72,51.6 72,43.7 72.6,43.1 75.5,43.1 76,42.6 GPIO-1.2 76,34.3 76.4,33.9 80,33.9 80.7,33.2 80.7,30.7 81.14,30.26 MC-I2C-3.GP17
BCM9
  Top 0.305: MC-I2C-2.GP17 70.84,30.26 70.3,30.8 70.3,51.9 68.8,53.4 J1.21
BCM10  (via drill 0.6)
  Top 0.305: MC-I2C-2.GP4 69.34,28.26 v69.3,28.3 | v69.3,31.5 69.3,51.2 68.6,51.9 66.9,51.9 66.3,52.5 66.3,56.16 J1.19
  Bottom 0.305: v69.3,28.3 v69.3,31.5
BCM12
  Top 0.254: 82.8,52 82.8,57.5 82.7,57.6 81.8,58.6
  Top 0.305: PWM.1 74,50.9 74.5,51.4 82.2,51.4 82.8,52 | 81.8,58.6 81.34,58.7 J1.32
BCM13
  Top 0.305: PWM.2 76,49.9 76.5,50.4 83.3,50.4 84,51.1 84,56.16 J1.33
BCM14_TX  (via drill 0.6)
  Top 0.254: 59.9,54.3 59.9,59.7 | U1.4 v32.99,35.11
  Top 0.305: SERIAL.2 63,52.4 61.7,53.6 60.6,53.6 59.9,54.3 | 59.9,59.7 59.1,60.4 51.86,60.4 51,59.7 51.02,59.68 J1.8 | v32.99,35.11 v33,35.1
  Bottom 0.305: SERIAL.2 63,36.17 61.93,35.1 v33,35.1
BCM15_RX  (via drill 0.6)
  Top 0.254: 57.4,53.8 57.4,57.1 57,57.5 54.8,57.5 J1.10
  Top 0.305: 53.6,58.78 J1.10 | SERIAL.1 61,52.1 60.3,52.7 58.4,52.7 57.4,53.8 | v28.1,31.3 U1.1
  Bottom 0.305: 60.95,46.2 SERIAL.1 61,37.34 60.3,36.64 32.05,36.64 31.1,35.7 31.1,31.8 30.6,31.3 v28.1,31.3
BCM16
  Bottom 0.254: 89,54.2 87.9,55.3 87.9,57.42 J1.36
  Bottom 0.305: GPIO-2.2 89,54.2
BCM17
  Top 0.305: 57.2,30.26 57.2,52.5 56.1,53.6 J1.11 | MC-I2C-1B.GP17 57.2,30.26 | 57.2,30.26 MC-I2C-1A.GP17
BCM19
  Bottom 0.305: GPIO-2.1 87,55.78 J1.35
BCM20
  Top 0.254: U$5.RED 87.9,54.15 87.9,57.52 J1.38
BCM21
  Top 0.305: SHUTDOWN.2 90.6,63 91.6,62 91.6,58.8 J1.40 91.72,58.8 93.2,58.8 93.7,58.3 93.7,54.4 93,53.5 U$5.RESET
BCM25
  Top 0.305: U4.2 69,62.8 69.5,62.3 69.5,61.3 68.8,60.6 J1.22
BCM26
  Top 0.254: U$5.GREEN 89.1,56.18
  Top 0.305: 89.1,56.18 J1.37
D+
  Top 0.406: J4.D+1 9.97,34.03 10.15,34.21 A.2
D-
  Top 0.406: J4.D-1 11.2,31.97 B.2
GND  (via drill 0.6)
  Top 0.305: U2.2 U2.1 42.7,42.11 v43.6,42.1 | v34.7,44.7 36.25,44.6 U2.6 | U4.1 U4.5 66.24,61.81 66.24,59.12 J1.20 | D5.C 2.7,55.35 JP2.1 | 9.7,36.7 7.9,36.7 7.5,37.1 7.85,37.1 8.4,36.55
  Top 0.406: C4.2 v29.8,46.1 | 34.7,48.5 v34.7,47.5 | C1.2 v20.2,26.4 | SHUTDOWN.1 77.85,62.95 78.9,61.8 78.9,58.8 J1.30 | v9.6,36.6 14.97,36.6 16.46,35.11 U1.5 | U$5.GND 87.1,48.2 86.7,47.8 80.4,47.7 80,47.3 PWM.4 | C6.2 43.1,41.6 v43.6,42.1
  Top 0.61: D6.C v97.4,25.5 | C3.2 v40.36,60.97 | C2.2 34.7,48.5 | MC-I2C-1A.GND MC-I2C-1B.GND MC-I2C-2.GND MC-I2C-3.GND 84.86,29.26 v85.3,29.3
  Top 0.813: U3.1 v36.49,51.21 v36.5,51.2
  Top 1.422: J4.GND1 8.4,36.55 9.95,36.55
  Bottom 0.406: 24.1,26.2 24.9,26.1
  other vias: 8.6,36.6 7.6,36.6 7.6,37.9 8.6,37.9 9.6,37.9 7.6,39.1 8.6,39.1 9.6,39.1 6.6,39.1 6.6,37.9 52.6,29.3 63.9,29.3
  pour Bottom (isolate 0.305, rank 6): -0.2,65.9 100,66.1 100.1,0 -0.1,-0.1
  pour Top: 5.6,36 10.1,36 10.1,39.5 9.8,39.8 5.9,39.8 5.6,39.5
ID_I2C_3V3
  Bottom 0.254: 72.6,64.2 72.6,57.7 | 72.6,57.7 72.4,57.5 64.8,57.5 64.8,57.28 J1.17 | 72.6,52.4 72.6,57.7
  Bottom 0.305: 72.6,52.4 73.2,51.8 R8.1 R9.1 | U5.8 73.1,64.7 72.75,64.35 | 72.75,64.35 72.6,64.2 | C5.1 72.75,64.35
N$1
  Bottom 0.305: U5.7 76.23,63.44 75.6,62.9 CFG.1
N$2
  Top 0.406: R5.2 D6.A
N$4
  Top 0.305: R4.2 D5.A
N$6
  Top 0.305: RTS.1 23.84,33.8 U1.3
  Top 0.406: U1.3 U1.2
N$7
  Top 0.305: R7.1 R6.1 JP1.2
N$8
  Top 0.305: NEOPIXELS.2 56.06,62.24 56.7,61.6 60.8,61.6 61.3,62.1 R3.1
N$9
  Top 0.305: 63.5,63.8 R3.2 | 65.65,63.8 U4.4
  Top 0.406: 65.65,63.8 R3.2
PI_3V3
  Top 1.93: J1.1 J7.1
PI_5V
  Top 0.406: R1.2 23.5,47 25.2,45.1 31.1,45.1 32.5,43.8 32.9,43.4 35.95,43.4 U2.7 | NEOPIXELS.3 53.52,65.02 53.8,65.3 67.7,65.3 68,65 68,63.85 U4.3 | J5.2 J6.2 21.16,60.54 20.91,60.9
  Top 0.61: C3.1 35.26,60.97 34.9,60.6 | 43.4,62.8 42,62.8 41.7,63.1 34.9,63.1
  Top 0.813: U3.3 34.9,60.6 34.9,63.1 | C3.1 34.96,60.97
  Top 1.422: 20.9,48 20.8,47.16 R1.2
  Top 1.676: 45.94,62.56 46,63.1
  Top 2.184: J1.4 45.94,62.56
  Top 2.54: NEOPIXELS.3 46,63.1 41.7,63.1 22.3,63.1 20.9,61.7 20.91,60.9 20.9,48 | J1.2 43.4,62.8
RS485_A
  Top 0.406: U1.6 16.32,33.84 15.95,34.21 A.1
RS485_B
  Top 0.406: U1.7 16.84,32.56 15.95,31.67 B.1
RTS
  Top 0.305: RTS.2 28.06,36.34 28.06,37.36 29,38.3 R2.1
SCL  (via drill 0.6)
  Top 0.305: J1.5 48.4,56.22 48.4,54.7 48,53.8 I2C-1.1 47.9,46.35 47.9,44.6 47.1,43.8 47.1,28.1 47.9,27.3 50.29,27.3 MC-I2C-1A.SCL | MC-I2C-3.SCL MC-I2C-2.SCL MC-I2C-1B.SCL MC-I2C-1A.SCL | R7.2 57.33,14.8 DISPLAY.3 | MC-I2C-1A.SCL 54.24,27.26 v54.3,27.2
  Top 0.406: U2.4 46.3,45.91 46.8,46.4 47.95,46.4 I2C-1.1
  Bottom 0.305: v54.3,27.2 54.3,15.9 55.3,14.9 57.13,14.9 DISPLAY.3
SDA  (via drill 0.6)
  Top 0.254: I2C-1.2 50,47.4 49.8,47.6 49.8,57.1 49.4,57.5 46.64,57.5 46,56.9 | 45.94,56.84 J1.3
  Top 0.305: 46,56.9 45.94,56.84 | U2.3 45.06,44.63 v45.4,44.6 45.4,26.9 46.04,26.26 MC-I2C-1A.SDA | MC-I2C-3.SDA MC-I2C-2.SDA MC-I2C-1B.SDA MC-I2C-1A.SDA | R6.2 DISPLAY.4 | MC-I2C-1A.SDA 57.44,26.26 v57.5,26.2
  Bottom 0.305: v45.4,44.6 49.5,44.6 50,45.1 I2C-1.2 | v57.5,26.2 DISPLAY.4

### Text on the board
tNames: 5V Out | + | GND | 5V | + | LM1117-3.3 / Max 800mA | GND | Pi 3v3 | Connect to use / Raspi 3v3 | + | 5V DC IN | SCL | SDA | 3v3 | GND | RX | TX | 3v3 | GND | 12 | 13 | 3v3 | GND | Front / Panel | Power & RS485 Bus | RS485 Bus / D+ -> A / D- -> B | 5 | 6 | 3v3 | GND | 19 | 16 | 3v3 | GND | 17 | GND | 17 | 9 | 6 | 5V | 4 | GND | GND | GND | SCL | 4 | 10 | 5 | SDA | SCL | SCL | SCL | 3v3 | SDA | SDA | SDA | 3v3 | 3v3 | 3v3 | 3v3 | 3v3 | I2C Pull-ups | S.Harrison | 9 Feb Jan 2019 | McPiFace.com | https://github.com/McPiFace/TopHat | V1.0 | GND | McPi Top Hat
bNames: + | 5V DC | GND | + | RS485 / D+ -> A / D- -> B | V1.0